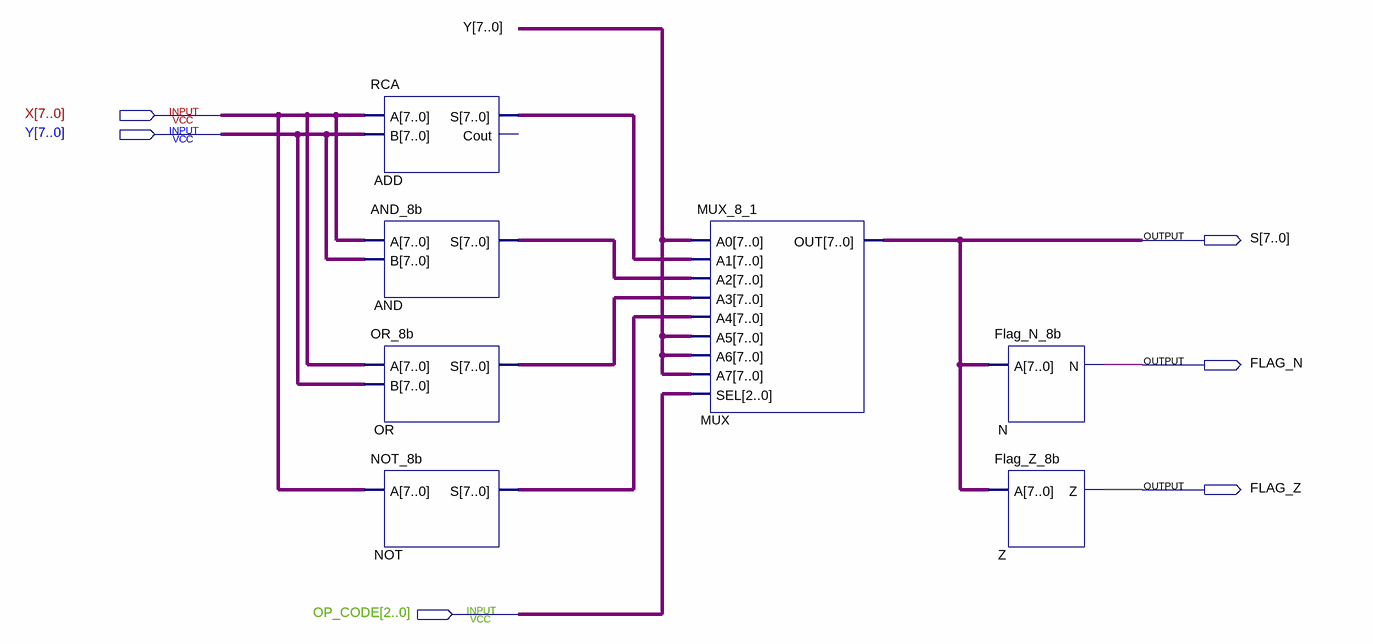
[diagram p0: schematic sheet]
// Quartus schematic ULA.bdf as structural Verilog: 7 symbols, 6 pins
module ULA (
  input  [7:0] X,
  input  [7:0] Y,
  input  [2:0] OP_CODE,
  output [7:0] S,
  output FLAG_N,
  output FLAG_Z
);

  wire [7:0] ADD_s, AND_s, NOT_s, OR_s;

  RCA ADD (.A(X), .B(Y), .S(ADD_s));  // open: Cout
  AND_8b AND (.A(X), .B(Y), .S(AND_s));
  OR_8b OR (.A(X), .B(Y), .S(OR_s));
  NOT_8b NOT (.A(X), .S(NOT_s));
  MUX_8_1 MUX (.A0(Y), .A1(ADD_s), .A2(AND_s), .A3(OR_s), .A4(NOT_s), .A5(Y), .A6(Y), .A7(Y), .SEL(OP_CODE), .OUT(S));
  Flag_N_8b N (.A(S), .N(FLAG_N));
  Flag_Z_8b Z (.A(S), .Z(FLAG_Z));
endmodule
